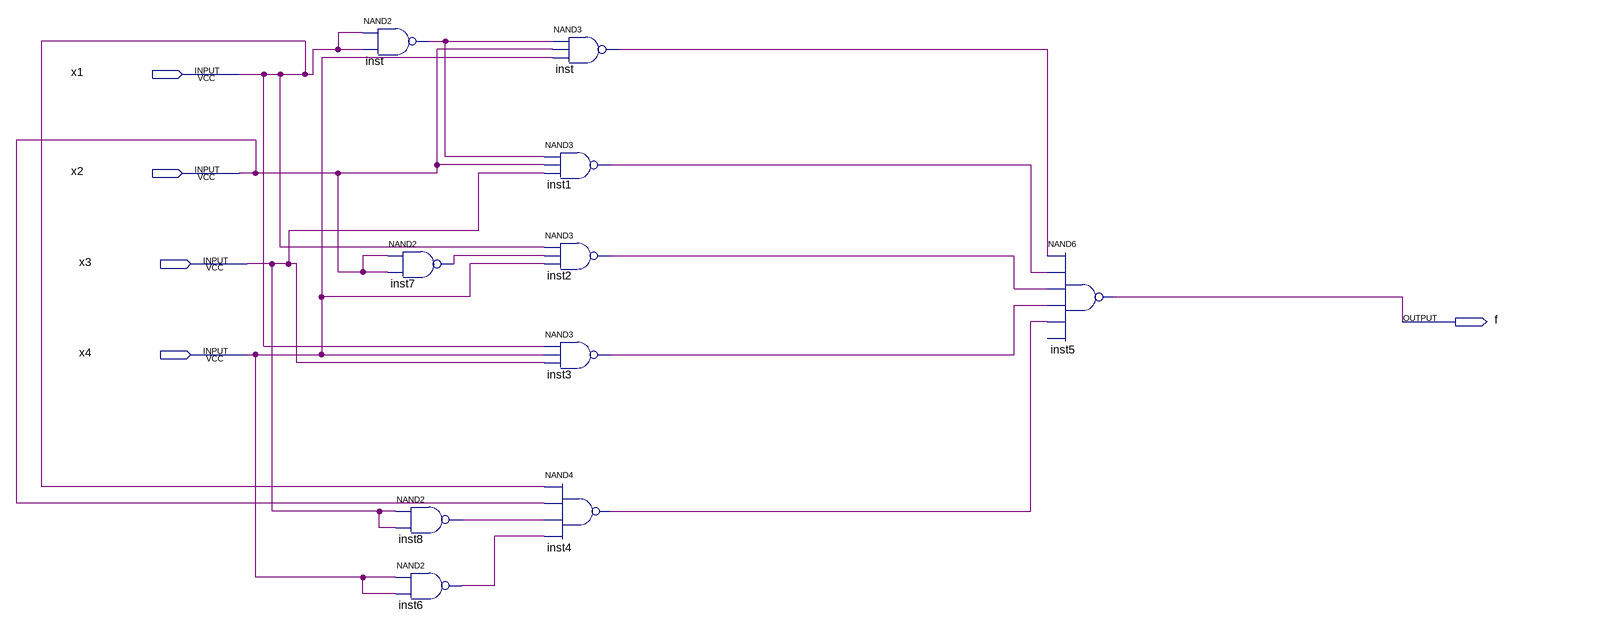
[diagram p0: schematic sheet]
// Quartus schematic lab2_real.bdf as structural Verilog: 10 symbols, 5 pins
module lab2_real (
  input  x1,
  input  x2,
  input  x3,
  input  x4,
  output f
);

  wire inst1_out, inst2_out, inst3_out, inst4_out, inst6_out, inst7_out, inst8_out, inst_out, inst_out_2;

  nand inst (inst_out, x1, x1);
  nand inst7 (inst7_out, x2, x2);
  nand inst8 (inst8_out, x3, x3);
  nand inst6 (inst6_out, x4, x4);
  nand inst_dup2 (inst_out_2, inst_out, x2, x4);
  nand inst1 (inst1_out, inst_out, x2, x3);
  nand inst2 (inst2_out, x1, inst7_out, x4);
  nand inst3 (inst3_out, x1, x4, x3);
  nand inst4 (inst4_out, x1, x2, inst8_out, inst6_out);
  nand inst5 (f, inst_out_2, inst1_out, inst2_out, inst3_out, inst4_out);  // open: IN6
endmodule
